# Altium project CAN Breakout.PrjPcb
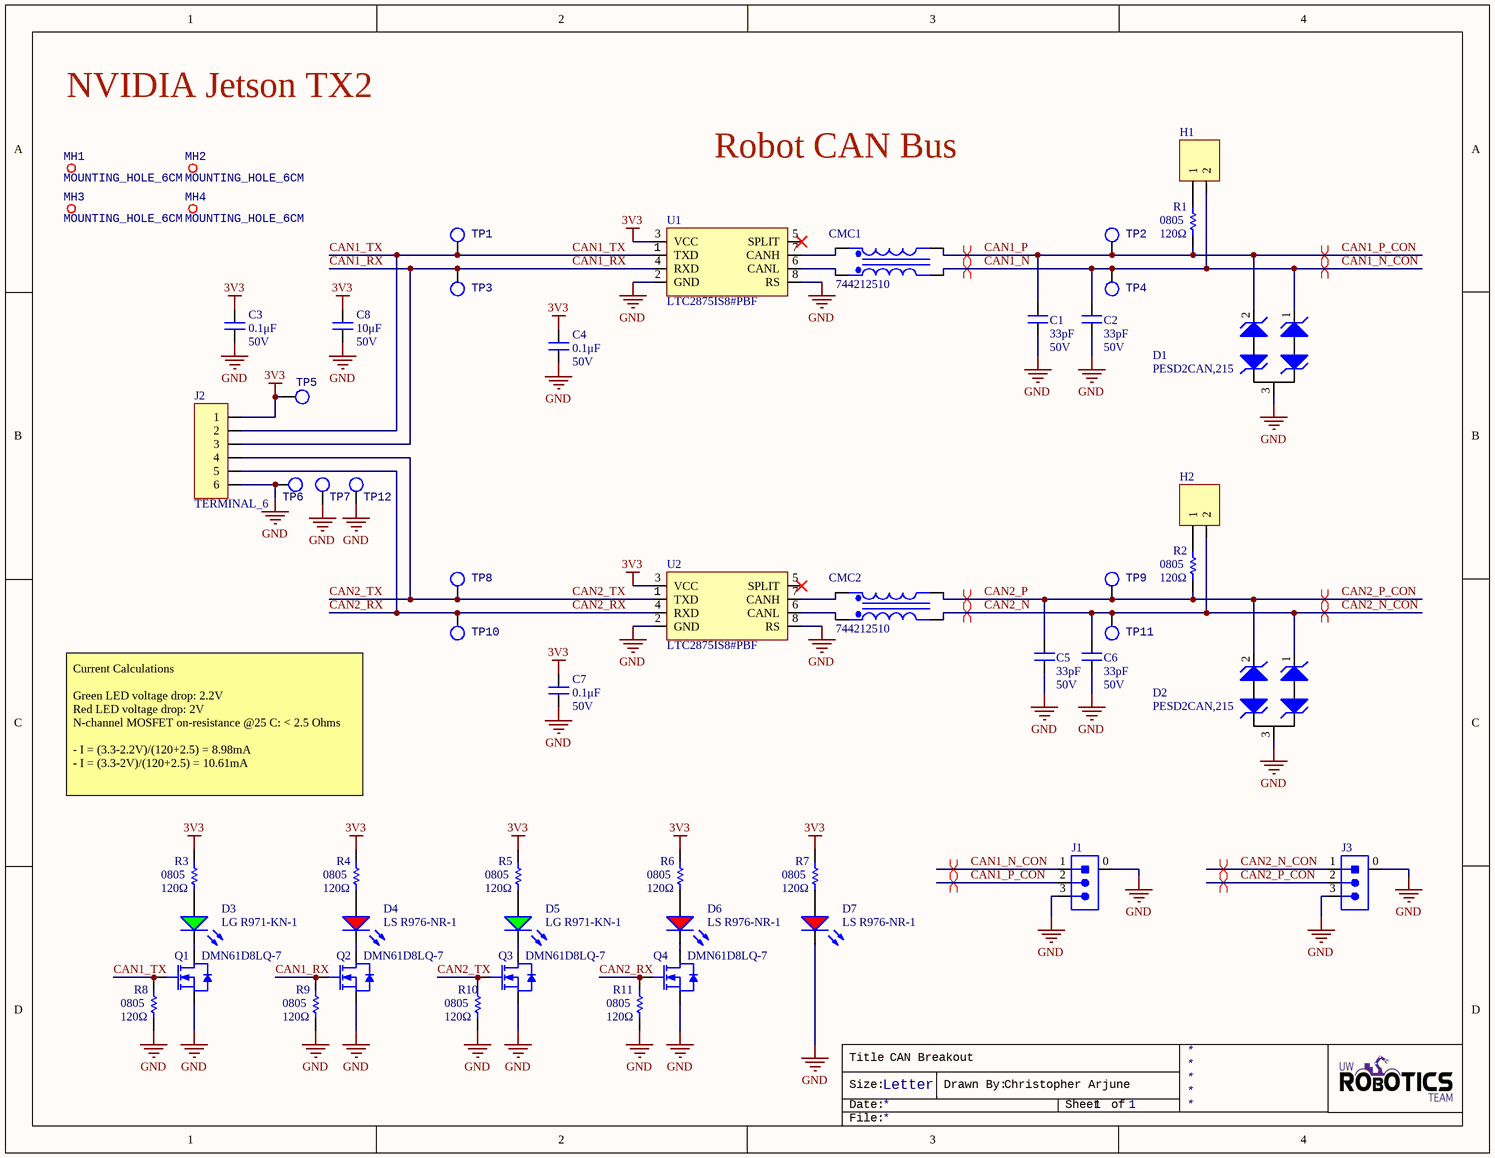
[diagram p0: CAN Breakout.SchDoc]
1 sheet, 55 parts. Net scope: global (net labels, ports and power ports of the same name join across sheets).
Board file: CAN Breakout.PcbDoc

## Sheet CAN Breakout.SchDoc: CAN Breakout
size Letter; DrawnBy: Christopher Arjune; SheetNumber: 1; SheetTotal: 1

### Parts
C1  value 33pF  Voltage: 50V  [CAPC0603(1608)55_N]  (hidden comment: CAP_33pF_50V_0603)
C2  value 33pF  Voltage: 50V  [CAPC0603(1608)55_N]  (hidden comment: CAP_33pF_50V_0603)
C3  Voltage Rating: 50V  [CAPC2012X140N]  (hidden comment: 0.1μF)
C4  Voltage Rating: 50V  [CAPC2012X140N]  (hidden comment: 0.1μF)
C5  value 33pF  Voltage: 50V  [CAPC0603(1608)55_N]  (hidden comment: CAP_33pF_50V_0603)
C6  value 33pF  Voltage: 50V  [CAPC0603(1608)55_N]  (hidden comment: CAP_33pF_50V_0603)
C7  Voltage Rating: 50V  [CAPC2012X140N]  (hidden comment: 0.1μF)
C8  value 10μF  Voltage Rating: 50V  [CAPC1206(3216)]  (hidden comment: 10uF)
CMC1  *  [744212510]  (value not drawn)
CMC2  *  [744212510]  (value not drawn)
D1  Manufacturer Part Number 1: PESD2CAN,215  [TVS_DIODE_CAN]  (hidden comment: TVS_DIODE_CAN)
D2  Manufacturer Part Number 1: PESD2CAN,215  [TVS_DIODE_CAN]  (hidden comment: TVS_DIODE_CAN)
D3  LG R971-KN-1  [LED_0805_LINE]
D4  LS R976-NR-1  [LED_0805_LINE]
D5  LG R971-KN-1  [LED_0805_LINE]
D6  LS R976-NR-1  [LED_0805_LINE]
D7  LS R976-NR-1  [LED_0805_LINE]
H1  JUMPER_2  [HDR1X2]  (value not drawn)
H2  JUMPER_2  [HDR1X2]  (value not drawn)
J1  *  [MOLEX-5025850370]  (value not drawn)
J2  TERMINAL_6  [OSTYK51106030]
J3  *  [MOLEX-5025850370]  (value not drawn)
MH1  MOUNTING_HOLE_6CM  [MOUNTING_HOLE]
MH2  MOUNTING_HOLE_6CM  [MOUNTING_HOLE]
MH3  MOUNTING_HOLE_6CM  [MOUNTING_HOLE]
MH4  MOUNTING_HOLE_6CM  [MOUNTING_HOLE]
Q1  Manufacturer Part Number 1: DMN61D8LQ-7  [SOT23-3]  (hidden comment: NMOS_60V_470mA)
Q2  Manufacturer Part Number 1: DMN61D8LQ-7  [SOT23-3]  (hidden comment: NMOS_60V_470mA)
Q3  Manufacturer Part Number 1: DMN61D8LQ-7  [SOT23-3]  (hidden comment: NMOS_60V_470mA)
Q4  Manufacturer Part Number 1: DMN61D8LQ-7  [SOT23-3]  (hidden comment: NMOS_60V_470mA)
R1  Case Code (Imperial): 0805  Resistance: 120Ω  [RESC2012X60N]  (hidden comment: 120)
R2  Case Code (Imperial): 0805  Resistance: 120Ω  [RESC2012X60N]  (hidden comment: 120)
R3  Case Code (Imperial): 0805  Resistance: 120Ω  [RESC2012X60N]  (hidden comment: 120)
R4  Case Code (Imperial): 0805  Resistance: 120Ω  [RESC2012X60N]  (hidden comment: 120)
R5  Case Code (Imperial): 0805  Resistance: 120Ω  [RESC2012X60N]  (hidden comment: 120)
R6  Case Code (Imperial): 0805  Resistance: 120Ω  [RESC2012X60N]  (hidden comment: 120)
R7  Case Code (Imperial): 0805  Resistance: 120Ω  [RESC2012X60N]  (hidden comment: 120)
R8  Case Code (Imperial): 0805  Resistance: 120Ω  [RESC2012X60N]  (hidden comment: 120)
R9  Case Code (Imperial): 0805  Resistance: 120Ω  [RESC2012X60N]  (hidden comment: 120)
R10  Case Code (Imperial): 0805  Resistance: 120Ω  [RESC2012X60N]  (hidden comment: 120)
R11  Case Code (Imperial): 0805  Resistance: 120Ω  [RESC2012X60N]  (hidden comment: 120)
TP1  TESTPOINT_LOOP  [TESTPOINT_LOOP]  (value not drawn)
TP2  TESTPOINT_LOOP  [TESTPOINT_LOOP]  (value not drawn)
TP3  TESTPOINT_LOOP  [TESTPOINT_LOOP]  (value not drawn)
TP4  TESTPOINT_LOOP  [TESTPOINT_LOOP]  (value not drawn)
TP5  TESTPOINT_LOOP  [TESTPOINT_LOOP]  (value not drawn)
TP6  TESTPOINT_LOOP  [TESTPOINT_LOOP]  (value not drawn)
TP7  TESTPOINT_LOOP  [TESTPOINT_LOOP]  (value not drawn)
TP8  TESTPOINT_LOOP  [TESTPOINT_LOOP]  (value not drawn)
TP9  TESTPOINT_LOOP  [TESTPOINT_LOOP]  (value not drawn)
TP10  TESTPOINT_LOOP  [TESTPOINT_LOOP]  (value not drawn)
TP11  TESTPOINT_LOOP  [TESTPOINT_LOOP]  (value not drawn)
TP12  TESTPOINT_LOOP  [TESTPOINT_LOOP]  (value not drawn)
U1  Manufacturer Part Number 1: LTC2875IS8#PBF  [LT-S8_N]  (hidden comment: IC TXRX CAN)
U2  Manufacturer Part Number 1: LTC2875IS8#PBF  [LT-S8_N]  (hidden comment: IC TXRX CAN)

### Nets
3V3: C3.2 C4.2 C7.2 C8.2 J2.1 R3.2 R4.2 R5.2 R6.2 R7.2 TP5.1 U1.3(VCC) U2.3(VCC)
GND: C1.1 C2.1 C3.1 C4.1 C5.1 C6.1 C7.1 C8.1 D1.3 D2.3 D7.2(K) J1.0 J1.3 J2.6 J3.0 J3.3 Q1.2(SOURCE) Q2.2(SOURCE) Q3.2(SOURCE) Q4.2(SOURCE) R8.1 R9.1 R10.1 R11.1 TP6.1 TP7.1 TP12.1 U1.2(GND) U1.8(RS) U2.2(GND) U2.8(RS)
CAN1_N: C2.2 CMC1.5(Pri-) D1.1 H1.2 J1.1 TP4.1  [also labelled CAN1_N_CON]
CAN1_P: C1.2 CMC1.4(Sec-) D1.2 J1.2 R1.1 TP2.1  [also labelled CAN1_P_CON]
CAN1_RX: J2.3 Q2.1(GATE) R9.2 TP3.1 U1.4(RXD)
CAN1_TX: J2.2 Q1.1(GATE) R8.2 TP1.1 U1.1(TXD)
CAN2_N: C6.2 CMC2.5(Pri-) D2.1 H2.2 J3.1 TP11.1  [also labelled CAN2_N_CON]
CAN2_P: C5.2 CMC2.4(Sec-) D2.2 J3.2 R2.1 TP9.1  [also labelled CAN2_P_CON]
CAN2_RX: J2.5 Q4.1(GATE) R11.2 TP10.1 U2.4(RXD)
CAN2_TX: J2.4 Q3.1(GATE) R10.2 TP8.1 U2.1(TXD)
NetCMC1_1: CMC1.1(Pri+) U1.6(CANL)
NetCMC1_3: CMC1.3(Sec+) U1.7(CANH)
NetCMC2_1: CMC2.1(Pri+) U2.6(CANL)
NetCMC2_3: CMC2.3(Sec+) U2.7(CANH)
NetD3_1: D3.1(A) R3.1
NetD3_2: D3.2(K) Q1.3(DRAIN)
NetD4_1: D4.1(A) R4.1
NetD4_2: D4.2(K) Q2.3(DRAIN)
NetD5_1: D5.1(A) R5.1
NetD5_2: D5.2(K) Q3.3(DRAIN)
NetD6_1: D6.1(A) R6.1
NetD6_2: D6.2(K) Q4.3(DRAIN)
NetD7_1: D7.1(A) R7.1
NetH1_1: H1.1 R1.2
NetH2_1: H2.1 R2.2

Not connected (* = marked no-connect by the designer): U1 5(SPLIT)*; U2 5(SPLIT)*

### Layout directives
differential pair: CAN1_N, CAN1_P, CAN2_N, CAN2_P

### Notes on the sheet
- NVIDIA Jetson TX2
- Robot CAN Bus
- Current Calculations
  Green LED voltage drop: 2.2V
  Red LED voltage drop: 2V
  N-channel MOSFET on-resistance @25 C: < 2.5 Ohms
  - I = (3.3-2.2V)/(120+2.5) = 8.98mA
  - I = (3.3-2V)/(120+2.5) = 10.61mA
- Title
- Size:
- Date:
- Letter
- Drawn By:
- Sheet
- of
- File:

### Library data of the parts
C1 C2 C5 C6 = CAP_33pF_50V_0603: CAP CER 33PF 50V C0G/NP0; Manufacturer 1: Yageo; Manufacturer Part Number 1: CC0603JRNPO9BN330; Dielectric Material: Ceramic; Temperature Coefficient: 30ppm/°C; Tolerance: 5%; Dielectric: C0G, NP0; Insulation Resistance: 100GR; Supplier 1: Digi-Key; Mount: Surface Mount; Number of Pins: 2; Case Code (Metric): 1608; Min Operating Temperature: -55°C; Max Operating Temperature: 125°C; Termination: SMD/SMT; Composition: Ceramic; Voltage Rating: 50V; Voltage Rating (DC): 50V; Length: 1.6mm; Height: 0.8mm; Thickness: 0.035inch; Depth: 0.8mm; Width: 0.031inch; REACH SVHC: No SVHC; ComponentLink7URL: https://datasheet.ciiva.com/11464/upy-gp-np0-16v-to-50v-8-11464730.pdf?src-supplier=Avnet; ComponentLink7Description: https://datasheet.ciiva.com/11464/upy-gp-np0-16v-to-50v-8-11464730.pdf?src-supplier=Avnet; ComponentLink8URL: https://datasheet.ciiva.com/46430/1835847-46430155.pdf?src-supplier=Element14; ComponentLink8Description: https://datasheet.ciiva.com/46430/1835847-46430155.pdf?src-supplier=Element14; ComponentLink9URL: https://datasheet.ciiva.com/144/mlccorderingcode-144644.pdf?src-supplier=Digi-Key; ComponentLink9Description: https://datasheet.ciiva.com/144/mlccorderingcode-144644.pdf?src-supplier=Digi-Key; ComponentLink10URL: https://datasheet.ciiva.com/5426/upy-gp-np0-16v-to-50v-8-5426614.pdf?src-supplier=Mouser; ComponentLink10Description: https://datasheet.ciiva.com/5426/upy-gp-np0-16v-to-50v-8-5426614.pdf?src-supplier=Mouser; ComponentLink11URL: https://datasheet.ciiva.com/7978/1443161-7978142.pdf?src-supplier=Element14; ComponentLink11Description: https://datasheet.ciiva.com/7978/1443161-7978142.pdf?src-supplier=Element14; Supplier Part Number 1: 311-1064-1-ND; Package: 0603; Case Code (Imperial): 0603
C3 C4 C7 = CAP_0.1uF_50V_0805: CAP CER 0.1UF 50V X7R 0805; Manufacturer Part Number 1: GCD21BR71H104KA01L; Manufacturer 1: Murata Electronics; Tolerance: 10%; Value: 0.1μF; Supplier Part Number 1: 490-11955-1-ND; Supplier 1: Digi-Key; Mount: Surface Mount; Case Code (Metric): 2012; Case Code (Imperial): 0805; Min Operating Temperature: -55°C; Max Operating Temperature: 125°C; Dielectric: X7R; Termination: SMD/SMT; Length: 2mm; Height: 1.25mm; Width: 0.049inch; Thickness: 0.049inch; Depth: 1.25mm; Ratings: AEC-Q200; Package: 0805 (2012 Metric)
C8 = CAP_10uF_50V_1206: CAP CER 10UF 50V X5R 1206; Manufacturer Part Number 1: GRT31CR61H106KE01L; Manufacturer 1: Murata; Supplier Part Number 1: 490-12456-1-ND; Supplier 1: Digi-Key; Mount: Surface Mount; Case Code (Metric): 3216; Case Code (Imperial): 1206; Dielectric: X5R; Manufacturer Part Numer 1: GRT31CR61H106KE01L; Dimensions: 0.126" L x 0.063" W (3.20mm x 1.6mm); Package: 1206 (3216 Metric)
CMC1 CMC2 = CMC_51uH: CMC 51uH 300MA 2LN SMD; Manufacturer 1: Wurth Electronics; Core Material: Ferrite; DC Resistance (DCR): 160mR; Test Frequency: 100kHz; Inductance Tolerance: 50%; Voltage Rating (DC): 80V; Number of Lines: 2; Impedance: 300R; Supplier 1: Digi-Key; Mount: Surface Mount; Case/Package: SMD/SMT; Number of Pins: 4; Min Operating Temperature: -40°C; Max Operating Temperature: 105°C; Current: 300mA; Max DC Current: 300mA; Termination: SMD/SMT; Current Rating: 300mA; Inductance: 51uH; Tolerance: 50%; Length: 6.5mm; Height: 1.65mm; Depth: 3.6mm; Width: 0.142inch; REACH SVHC: No SVHC; ComponentLink7URL: https://datasheet.ciiva.com/6216/744212510-6216348.pdf?src-supplier=Digi-Key; ComponentLink7Description: https://datasheet.ciiva.com/6216/744212510-6216348.pdf?src-supplier=Digi-Key; ComponentLink8URL: https://datasheet.ciiva.com/7764/1735560-7764951.pdf?src-supplier=Element14; ComponentLink8Description: https://datasheet.ciiva.com/7764/1735560-7764951.pdf?src-supplier=Element14; Supplier Part Number 1: 732-3941-1-ND; Manufacturer Part Number 1: 744212510
D1 D2 = TVS_DIODE_CAN: TVS DIODE 24V 41V SOT323-3; Manufacturer 1: Nexperia USA Inc.; Package: SC-70, SOT-323; Supplier Part Number 1: 1727-3891-1-ND; Supplier 1: Digi-Key; Mount: Surface Mount
D3 D5 = DIO_LED_G: LED GREEN DIFFUSED 0805 SMD; Manufacturer 1: OSRAM; Forward Voltage Drop: 2.2V; Package: 0805 (2012 Metric); Manufacturer Part Number 1: LG R971-KN-1; Supplier Part Number 1: 475-1410-1-ND; Supplier 1: Digi-Key; Mount: Surface Mount
D4 D6 D7 = DIO_LED_R: LED RED DIFFUSED 0805 SMD; Manufacturer 1: OSRAM; Forward Voltage Drop: 2V; Package: 0805 (2012 Metric); Manufacturer Part Number 1: LS R976-NR-1; Supplier Part Number 1: 475-1278-1-ND; Supplier 1: Digi-Key; Mount: Surface Mount
H1 H2 = JUMPER_2: HEADER 2X1; Manufacturer 1: TE Connectivity; Manufacturer Part Number 1: 87220-2; Supplier 1: Digi-Key; Supplier Part Number 1: A26542-ND; Mount: Through Hole
J1 J3 = CON_3M_SM_RA: CONN RCPT 3POS 0.059 TIN SMD R/A; Manufacturer 1: Molex; Number of Contacts: 3; Current Rating: 2A; Voltage Rating: 100V; Connector Type: Receptacle,Center Strip Contact; Gender: Female; Contact Resistance: 20mR; Pitch: 1.5mm; Glow Wire Compliant: Non-compliant; Supplier 1: Digi-Key; Category: Headers and Wire Housings; Stock 2: 133; Pricing 2: 1=0.53000, 10=0.50100, 100=0.38380, 500=0.33374 (USD); Mount: Surface Mount; Housing Color: Beige; Contact Plating: Tin; Color: Beige; Housing Material: Thermoplastic; Contact Material: Copper Alloy; Min Operating Temperature: -40°C; Max Operating Temperature: 85°C; Number of Rows: 1; Termination: Solder; Orientation: Right Angle; Fastening Type: Latch; Number of Positions: 3; Number of Circuits: 3; Contact Gender: Female; Length: 8.8mm; Depth: 7.3mm; REACH SVHC: No SVHC; Supplier Part Number 1: WM12831CT-ND
J2 = TERMINAL_6: Header, 6-Pin; Manufacturer 1: On-Shore Technology; Current Rating: 30A; Voltage Rating: 300V; Number of Circuits: 6; Wire Gauge (Max): 22AWG; Wire Gauge (Min): 10AWG; Pitch: 0.374inch; Supplier 1: Digi-Key; Manufacturer Part Number 1: OSTYK51106030; Stock 1: 2939; Pricing 1: 1=2.56000, 10=1.93600, 25=1.79440, 50=1.61340, 100=1.57400, 250=1.37724, 500=1.25920, 1000=1.14115, 5000=1.00343 (USD); RoHS: Yes; Mount: Through Hole; Color: Black; Insulation Material: Nylon; Min Operating Temperature: -40°C; Max Operating Temperature: 115°C; Number of Rows: 1; Packaging: Bulk; Number of Wire Entries: 6; Flammability Rating: UL94 V-0; ComponentLink1URL: http://www.on-shore.com/wp-content/uploads/2015/09/ostyk511xx030.pdf?src-supplier=Digi-Key; ComponentLink1Description: http://www.on-shore.com/wp-content/uploads/2015/09/ostyk511xx030.pdf?src-supplier=Digi-Key; Supplier Part Number 1: ED2957-ND
Q1-Q4 = NMOS_60V_470mA: MOSFET N-CH 60V SOT23; Manufacturer 1: Diodes; Continuous Drain Current (ID): 470mA; Rds On Max: 1.8R; Input Capacitance: 12.9pF; Max Power Dissipation: 390mW; ComponentLink1URL: http://www.farnell.com/datasheets/2814413.pdf?src-supplier=Farnell; ComponentLink1Description: http://www.farnell.com/datasheets/2814413.pdf?src-supplier=Farnell; ComponentLink2URL: http://www.mouser.com/ds/2/115/DMN61D8LQ-776439.pdf?src-supplier=Mouser; ComponentLink2Description: http://www.mouser.com/ds/2/115/DMN61D8LQ-776439.pdf?src-supplier=Mouser; ComponentLink3URL: https://www.diodes.com/assets/Datasheets/DMN61D8LQ.pdf?src-supplier=Digi-Key; ComponentLink3Description: https://www.diodes.com/assets/Datasheets/DMN61D8LQ.pdf?src-supplier=Digi-Key; Supplier 1: Digi-Key; Stock 1: 72; Pricing 1: 1=0.44000, 10=0.37900, 25=0.35360, 100=0.26260, 500=0.20504, 1000=0.16665 (USD); RoHS: Yes; Mount: Surface Mount; Case/Package: TO-236-3; Min Operating Temperature: -55°C; Max Operating Temperature: 150°C; Packaging: Tape and Reel; Drain to Source Voltage (Vdss): 60V; Supplier Part Number 1: DMN61D8LQ-7DICT-ND
R1-R11 = RES_120Ω_0805: RES SMD 120 OHM 1% 1/8W 0805; Manufacturer 1: Vishay; Manufacturer Part Number 1: CRCW0805120RFKEA; Power Rating: 125mW; Voltage Rating: 150V; ComponentLink7URL: https://datasheet.ciiva.com/2467/dcrcwe3-2467513.pdf?src-supplier=Digi-Key; ComponentLink7Description: https://datasheet.ciiva.com/2467/dcrcwe3-2467513.pdf?src-supplier=Digi-Key; ComponentLink8URL: https://datasheet.ciiva.com/16852/dcrcwe3-16852841.pdf?src-supplier=Avnet+Europe; ComponentLink8Description: https://datasheet.ciiva.com/16852/dcrcwe3-16852841.pdf?src-supplier=Avnet+Europe; ComponentLink9URL: https://datasheet.ciiva.com/7777/1697337-7777354.pdf?src-supplier=Element14; ComponentLink9Description: https://datasheet.ciiva.com/7777/1697337-7777354.pdf?src-supplier=Element14; ComponentLink10URL: https://datasheet.ciiva.com/16788/70201119-16788154.pdf?src-supplier=Allied+Electronics; ComponentLink10Description: https://datasheet.ciiva.com/16788/70201119-16788154.pdf?src-supplier=Allied+Electronics; ComponentLink11URL: https://datasheet.ciiva.com/7777/1720486-7777567.pdf?src-supplier=Element14; ComponentLink11Description: https://datasheet.ciiva.com/7777/1720486-7777567.pdf?src-supplier=Element14; Supplier 1: Digi-Key; Mount: Surface Mount; Case Code (Metric): 2012; Supplier Part Number 1: 541-120CCT-ND; Package: 0805 (2012 Metric)
TP1-TP12 = TESTPOINT_LOOP: PC TEST POINT MINIATURE WHITE; Manufacturer Part Number 1: 5002; Manufacturer 1: Keystone Electronics; Supplier Part Number 1: 36-5002-ND; Supplier 1: Digi-Key; Mount: Through Hole
U1 U2 = LTC2875: IC TXRX CAN 4MBPS 8SO; Manufacturer 1: Linear Technologies; Package: 8-SOIC (0.154", 3.90mm Width); Supplier Part Number 1: LTC2875IS8#PBF-ND; Supplier 1: Digi-Key; Mount: Surface Mount